# Altium schematic sheet DBL 165 SerialIn Register (v2).SchDoc: DBL 165 Serial In Register
size A4; Organization: Controlled by GND; Revision: 0; SheetNumber: 1; SheetTotal: 1; Version: 2.0s; Variant: Controlled by GND; Modification: On IRF5850 Mosfet; Project: Light Control; PageSetup: Record=PageOptions|CenterHorizontal=True|CenterVertical=True|PrintScale=0.97|XCorrection=1.00|YCorrection=1.00|PrintKind=1|BorderSize=5000000|LeftOffset=0|BottomOffset=0|Orientation=2|PaperLength=2970|PaperWidth=2100|Scale=100|PaperSource=7|PrintQuality=-4|MediaType=1|DitherType=10|PaperKind=A4|PrintScaleMode=1; DocumentName: DBL 165 Serial In Register; ProjectName: LightControl
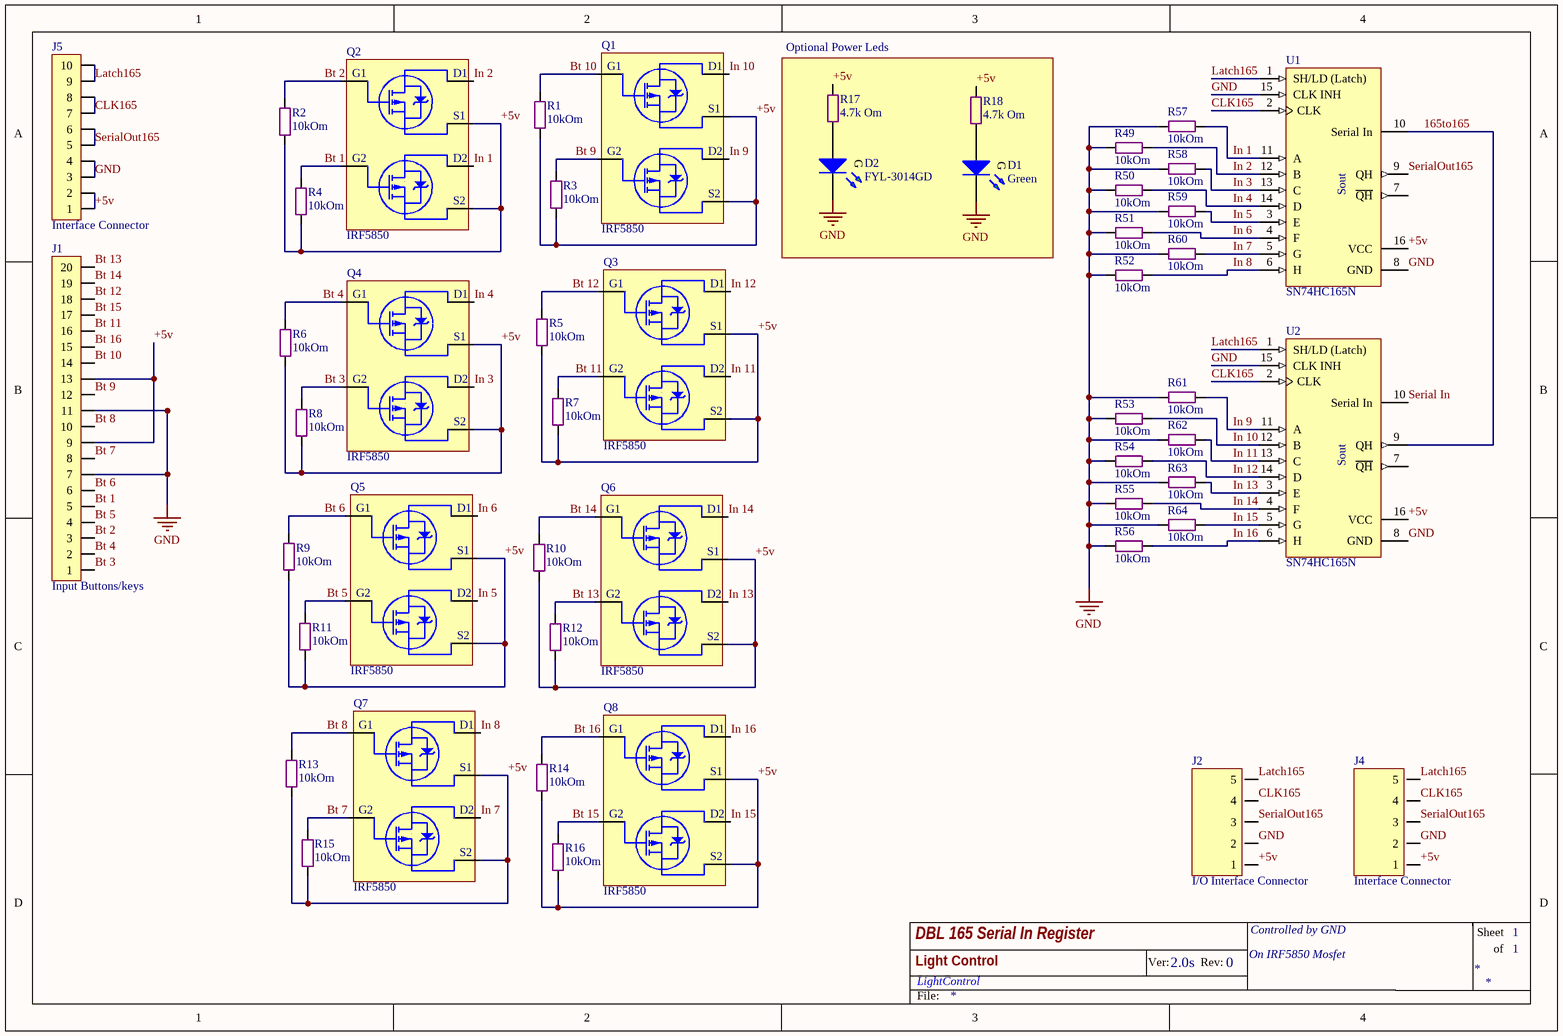
[diagram p0: DBL 165 SerialIn Register (v2).SchDoc]

## Parts
D1  Green  [LED SMD 0805 Green]
D2  FYL-3014GD  [LED Round 3mm Green]
J1  Input Buttons/keys  [LINE 2.54 x 20D (2 x 10) - BH]
J2  I/O Interface Connector  [Line 2.54 x 5]
J4  Interface Connector  [Line 2.54 x 5]
J5  Interface Connector  [LINE 2.54 x 10D (2 x 5) - BH]
Q1  IRF5850  [TSOP-6]
Q2  IRF5850  [TSOP-6]
Q3  IRF5850  [TSOP-6]
Q4  IRF5850  [TSOP-6]
Q5  IRF5850  [TSOP-6]
Q6  IRF5850  [TSOP-6]
Q7  IRF5850  [TSOP-6]
Q8  IRF5850  [TSOP-6]
R1  10kOm  [SMD 0805 (2012)]
R2  10kOm  [SMD 0805 (2012)]
R3  10kOm  [SMD 0805 (2012)]
R4  10kOm  [SMD 0805 (2012)]
R5  10kOm  [SMD 0805 (2012)]
R6  10kOm  [SMD 0805 (2012)]
R7  10kOm  [SMD 0805 (2012)]
R8  10kOm  [SMD 0805 (2012)]
R9  10kOm  [SMD 0805 (2012)]
R10  10kOm  [SMD 0805 (2012)]
R11  10kOm  [SMD 0805 (2012)]
R12  10kOm  [SMD 0805 (2012)]
R13  10kOm  [SMD 0805 (2012)]
R14  10kOm  [SMD 0805 (2012)]
R15  10kOm  [SMD 0805 (2012)]
R16  10kOm  [SMD 0805 (2012)]
R17  4.7k Om  [SMD 0805 (2012)]
R18  4.7k Om  [SMD 0805 (2012)]
R49  10kOm  [SMD 0805 (2012)]
R50  10kOm  [SMD 0805 (2012)]
R51  10kOm  [SMD 0805 (2012)]
R52  10kOm  [SMD 0805 (2012)]
R53  10kOm  [SMD 0805 (2012)]
R54  10kOm  [SMD 0805 (2012)]
R55  10kOm  [SMD 0805 (2012)]
R56  10kOm  [SMD 0805 (2012)]
R57  10kOm  [SMD 0805 (2012)]
R58  10kOm  [SMD 0805 (2012)]
R59  10kOm  [SMD 0805 (2012)]
R60  10kOm  [SMD 0805 (2012)]
R61  10kOm  [SMD 0805 (2012)]
R62  10kOm  [SMD 0805 (2012)]
R63  10kOm  [SMD 0805 (2012)]
R64  10kOm  [SMD 0805 (2012)]
U1  SN74HC165N  [DIP-16]
U2  SN74HC165N  [DIP-16]

## Blocks framed on the sheet
Optional Power Leds: D1 D2 R17 R18

## Nets
GND: D1.K D2.K J1.7 J1.11 J2.2 J4.2 J5.3 J5.4 R49.1 R50.1 R51.1 R52.1 R53.1 R54.1 R55.1 R56.1 R57.1 R58.1 R59.1 R60.1 R61.1 R62.1 R63.1 R64.1 U1.8(GND) U1.15(CLK_INH) U2.8(GND) U2.15(CLK_INH)
165to165: U1.10(Serial_In) U2.9(QH)
+5v: J1.9 J1.13 J2.1 J4.1 J5.1 J5.2 Q1.2(S2) Q1.5(S1) Q2.2(S2) Q2.5(S1) Q3.2(S2) Q3.5(S1) Q4.2(S2) Q4.5(S1) Q5.2(S2) Q5.5(S1) Q6.2(S2) Q6.5(S1) Q7.2(S2) Q7.5(S1) Q8.2(S2) Q8.5(S1) R1.2 R2.2 R3.2 R4.2 R5.2 R6.2 R7.2 R8.2 R9.2 R10.2 R11.2 R12.2 R13.2 R14.2 R15.2 R16.2 R17.1 R18.1 U1.16(VCC) U2.16(VCC)
Bt 1: J1.5 Q2.3(G2) R4.1
Bt 2: J1.3 Q2.1(G1) R2.1
Bt 3: J1.1 Q4.3(G2) R8.1
Bt 4: J1.2 Q4.1(G1) R6.1
Bt 5: J1.4 Q5.3(G2) R11.1
Bt 6: J1.6 Q5.1(G1) R9.1
Bt 7: J1.8 Q7.3(G2) R15.1
Bt 8: J1.10 Q7.1(G1) R13.1
Bt 9: J1.12 Q1.3(G2) R3.1
Bt 10: J1.14 Q1.1(G1) R1.1
Bt 11: J1.16 Q3.3(G2) R7.1
Bt 12: J1.18 Q3.1(G1) R5.1
Bt 13: J1.20 Q6.3(G2) R12.1
Bt 14: J1.19 Q6.1(G1) R10.1
Bt 15: J1.17 Q8.3(G2) R16.1
Bt 16: J1.15 Q8.1(G1) R14.1
CLK165: J2.4 J4.4 J5.7 J5.8 U1.2(CLK) U2.2(CLK)
In 1: Q2.4(D2) R57.2 U1.11(A)
In 2: Q2.6(D1) R49.2 U1.12(B)
In 3: Q4.4(D2) R58.2 U1.13(C)
In 4: Q4.6(D1) R50.2 U1.14(D)
In 5: Q5.4(D2) R59.2 U1.3(E)
In 6: Q5.6(D1) R51.2 U1.4(F)
In 7: Q7.4(D2) R60.2 U1.5(G)
In 8: Q7.6(D1) R52.2 U1.6(H)
In 9: Q1.4(D2) R61.2 U2.11(A)
In 10: Q1.6(D1) R53.2 U2.12(B)
In 11: Q3.4(D2) R62.2 U2.13(C)
In 12: Q3.6(D1) R54.2 U2.14(D)
In 13: Q6.4(D2) R63.2 U2.3(E)
In 14: Q6.6(D1) R55.2 U2.4(F)
In 15: Q8.4(D2) R64.2 U2.5(G)
In 16: Q8.6(D1) R56.2 U2.6(H)
Latch165: J2.5 J4.5 J5.9 J5.10 U1.1(SH/LD_(Latch)) U2.1(SH/LD_(Latch))
Serial In: U2.10(Serial_In)
SerialOut165: J2.3 J4.3 J5.5 J5.6 U1.9(QH)
NetD1_A: D1.A R18.2
NetD2_A: D2.A R17.2

Not connected (* = marked no-connect by the designer): U1 7(~{QH}); U2 7(~{QH})

## Notes on the sheet
- Ver:
- Rev:
- Sheet
- of
- File:
- (in symbol Led Round 3mm Green) G
- (in symbol Led SMD Green) G
- (in symbol SN74HC165N) Sout

## Library data of the parts
D1 = Led SMD Green: ?2v ?20mA; Forward Voltage TYP: ?2; Resistor for 5v VCC: 330 Om; Forward Voltage Min: ?; Wave len min/typ: ?; Liminous Min (mcd): ?; Liminous Typ (mcd): ?; Forward Amp (mA): ?; Color: Green
D2 = Led Round 3mm Green: 2.1v 10mA, 15-30mCd; Forward Voltage Max: 2.3; Forward Voltage TYP: 2.1; Wave len min/typ: 570nm; Liminous Typ (mcd): 15-30; Forward Amp (mA): 10; Color: Green; Name: FYL-3014GD
J1 = PLD-20 (2 x 10): Vert, Dbl line, Male
J2 J4 = PLS-5: Vert, Sgl line, Male
J5 = PLD-10 (2 x 5): Vert, Dbl line, Male
Q1-Q8 = IRF5850: Dual P-Ch  20V - 0.135Ω - 2.2A; Monufacturer: IOR; V DSS (v): -20 V; RDS Сопротивление Сток-Исток: 0.135 Om; I d - Drain current (continuous) at TC = 70°C: 1.8 A; VGS Порог Открытия: -0.45...-1.2 V; VGS Макс напр на гейте: +-12 V; C ISS Входная емкость: 320 pF; C OSS Выходная емкость: 56 pF; I d - Drain current (continuous) at TC = 25°C: 2.2 A; Name: IRF5850; Datasheet: http://tec.org.ru/_bd/4/490_IRF5850.pdf; URL: http://tec.org.ru/board/irf5850/49-1-0-490
R1-R18 R49-R64 = Res All Types
U1 U2 = SN74HC165N: 8-Bit Parallel-Load Shift Register; Published: 8-Jun-2000; LatestRevisionDate: 04-Mar-2005; LatestRevisionNote: Stylized 3D Model Added.; DatasheetVersion: May-1997; PackageVersion: Oct-1995; PackageReference: N016; Publisher: Altium Limited; PackageDescription: DIP; 16 Leads; Row Spacing 7.62 mm; Pitch 2.54 mm; Code_JEDEC: MS-001-BB; ComponentLink1Description: Manufacturer Link; ComponentLink1URL: http://www.ti.com/; ComponentLink2Description: Datasheet; ComponentLink2URL: http://www-s.ti.com/sc/ds/sn74hc165.pdf